# EAGLE schematic MotorBoard  (EAGLE 7.2.0)
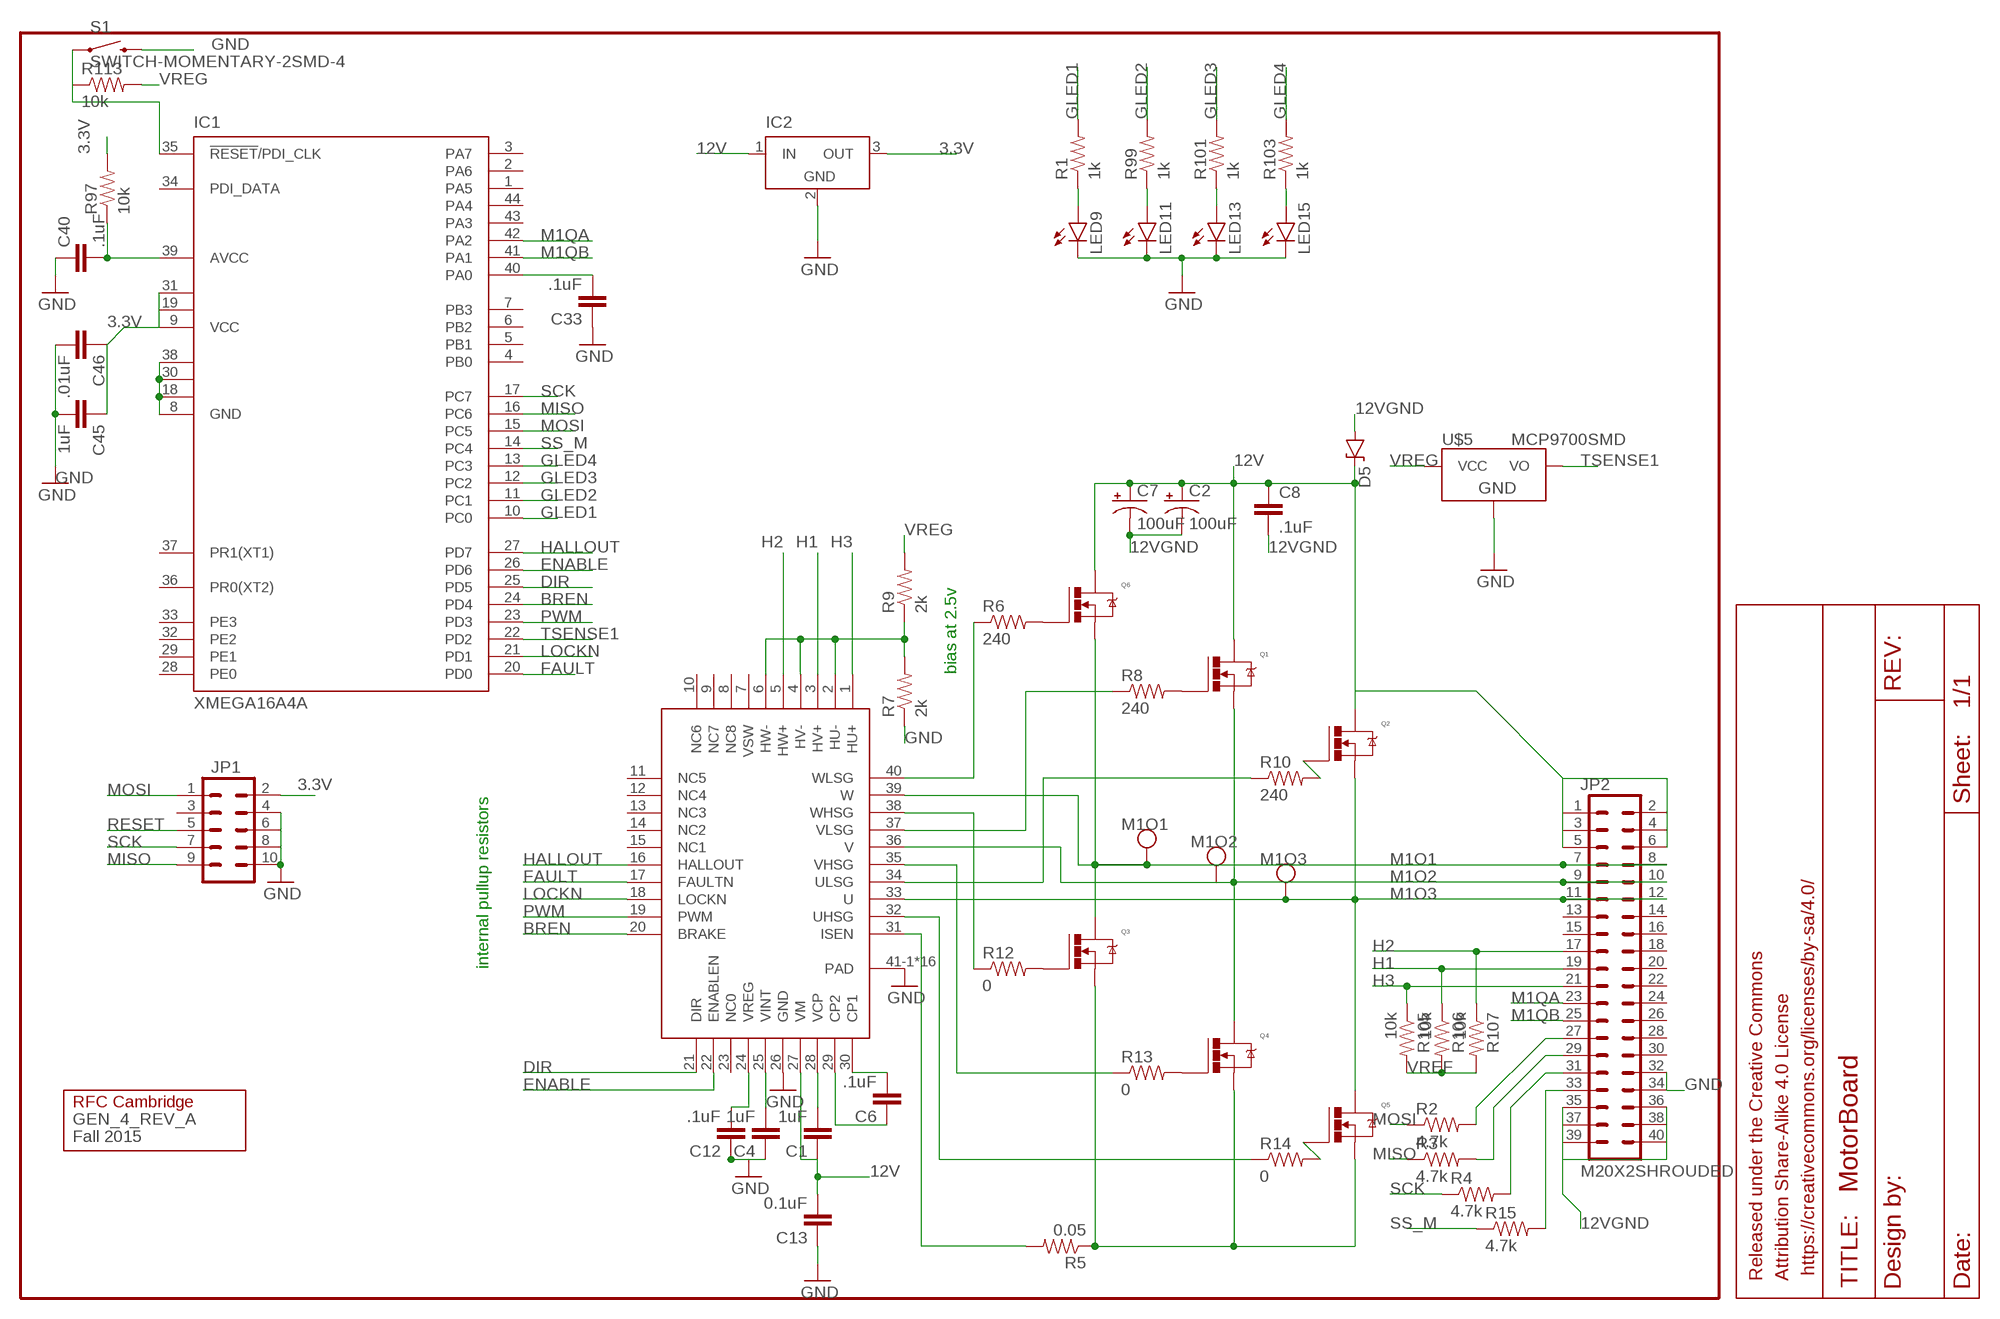
[diagram p0: schematic, sheet 1]

## Parts
C1  1uF  CAP0805  [0805]
C2  100uF  CAP-POLAR  [PANASONIC_D]
C4  1uF  CAP0805  [0805]
C6  .1uF  CAP0805  [0805]
C7  100uF  CAP-POLAR  [PANASONIC_D]
C8  .1uF  CAP0805  [0805]
C12  .1uF  CAP0805  [0805]
C13  0.1uF  CAP0805  [0805]
C33  .1uF  CAP0805  [0805]
C40  .1uF  CAP0805  [0805]
C45  1uF  CAP0805  [0805]
C46  .01uF  CAP0805  [0805]
D5  DIODE-ZENERDO214AC  [DO214AC]
FRAME7  FRAME-LETTER  [CREATIVE_COMMONS]
GEN_4_REV_A  Fall 2015  LOGO  [LOGO]
IC1  XMEGA16A4A  [TQFP44]
IC2  LT1129CST5  [SOT223]
JP1  M05X2SHD-NS  [2X5-SHROUDED-NS]
JP2  M20X2SHROUDED  [2X20_SHROUDED]
LED9  LED1206  [LED-1206]
LED11  LED1206  [LED-1206]
LED13  LED1206  [LED-1206]
LED15  LED1206  [LED-1206]
M1O1  TEST_PT  [TESTING_PT]
M1O2  TEST_PT  [TESTING_PT]
M1O3  TEST_PT  [TESTING_PT]
Q1  N-MOSFET  [DPAK]
Q2  N-MOSFET  [DPAK]
Q3  N-MOSFET  [DPAK]
Q4  N-MOSFET  [DPAK]
Q5  N-MOSFET  [DPAK]
Q6  N-MOSFET  [DPAK]
R1  1k  RESISTOR0805-RES  [0805]
R2  4.7k  RESISTOR0805-RES  [0805]
R3  4.7k  RESISTOR0805-RES  [0805]
R4  4.7k  RESISTOR0805-RES  [0805]
R5  0.05  RESISTOR0805-RES  [0805]
R6  240  RESISTOR0805-RES  [0805]
R7  2k  RESISTOR0805-RES  [0805]
R8  240  RESISTOR0805-RES  [0805]
R9  2k  RESISTOR0805-RES  [0805]
R10  240  RESISTOR0805-RES  [0805]
R12  0  RESISTOR0805-RES  [0805]
R13  0  RESISTOR0805-RES  [0805]
R14  0  RESISTOR0805-RES  [0805]
R15  4.7k  RESISTOR0805-RES  [0805]
R97  10k  RESISTOR0805-RES  [0805]
R99  1k  RESISTOR0805-RES  [0805]
R101  1k  RESISTOR0805-RES  [0805]
R103  1k  RESISTOR0805-RES  [0805]
R105  10k  RESISTOR0805-RES  [0805]
R106  10k  RESISTOR0805-RES  [0805]
R107  10k  RESISTOR0805-RES  [0805]
R113  10k  RESISTOR0805-RES  [0805]
S1  SWITCH-MOMENTARY-2SMD-4  [TACTILE_SWITCH_TALL]
U$1  DRV8307  [QFN40-6X6]
U$5  MCP9700SMD  [SOT23-3]

## Nets
3.3V: C45.1 C46.1 IC1.9(VCC) IC1.19(VCC1) IC1.31(VCC2) IC2.3(OUT) R97.2
12V: C1.1 C2.+ C7.+ C8.1 C13.2 D5.C IC2.1(IN) JP2.1 JP2.2 JP2.3 JP2.4 JP2.5 JP2.6 Q1.DRAIN Q2.DRAIN Q6.DRAIN U$1.27(VM)
12VGND: C2.- C7.- C8.2 D5.A JP2.35 JP2.36 JP2.37 JP2.38 JP2.39 JP2.40
AVCC: C40.2 IC1.39(AVCC) R97.1
BREN: IC1.24(PD4) U$1.20(BRAKE)
DIR: IC1.25(PD5) U$1.21(DIR)
ENABLE: IC1.26(PD6) U$1.22(ENABLEN)
FAULT: IC1.20(PD0) U$1.17(FAULTN)
GLED1: IC1.10(PC0) R1.2
GLED2: IC1.11(PC1) R99.2
GLED3: IC1.12(PC2) R101.2
GLED4: IC1.13(PC3) R103.2
GND: C4.1 C12.1 C13.1 C33.1 C40.1 C45.2 C46.2 IC1.8(GND) IC1.18(GND1) IC1.30(GND2) IC1.38(GND3) IC2.2(GND) JP1.4 JP1.6 JP1.8 JP1.10 LED9.C LED11.C LED13.C LED15.C R7.1 S1.B2 U$1.26(GND) U$1.41-1(PAD) U$1.41-2(PAD) U$1.41-3(PAD) U$1.41-4(PAD) U$1.41-5(PAD) U$1.41-6(PAD) U$1.41-7(PAD) U$1.41-8(PAD) U$1.41-9(PAD) U$1.41-10(PAD) U$1.41-11(PAD) U$1.41-12(PAD) U$1.41-13(PAD) U$1.41-14(PAD) U$1.41-15(PAD) U$1.41-16(PAD) U$5.3(GND)
H1: JP2.19 R106.1 U$1.3(HV+)
H2: JP2.17 R107.1 U$1.5(HW+)
H3: JP2.21 R105.1 U$1.1(HU+)
HALLOUT: IC1.27(PD7) U$1.16(HALLOUT)
LOCKN: IC1.21(PD1) U$1.18(LOCKN)
M1O1: JP2.7 JP2.8 M1O1.P$1 Q3.DRAIN Q6.SOURCE U$1.39(W)
M1O2: JP2.9 JP2.10 M1O2.P$1 Q1.SOURCE Q4.DRAIN U$1.36(V)
M1O3: JP2.11 JP2.12 M1O3.P$1 Q2.SOURCE Q5.DRAIN U$1.33(U)
M1QA: IC1.42(PA2) JP2.23
M1QB: IC1.41(PA1) JP2.25
MISO: IC1.16(PC6) R3.1
MOSI: IC1.15(PC5) JP1.1 R2.1
N$1: LED9.A R1.1
N$2: C6.2 U$1.30(CP1)
N$3: JP2.29 R3.2
N$4: JP2.31 R4.2
N$5: R5.2 U$1.31(ISEN)
N$6: Q6.GATE R6.2
N$7: Q1.GATE R8.2
N$8: C33.2 IC1.40(PA0)
N$9: C6.1 U$1.29(CP2)
N$10: Q2.GATE R10.2
N$11: Q3.GATE R12.2
N$12: C1.2 U$1.28(VCP)
N$13: Q4.GATE R13.2
N$14: Q5.GATE R14.2
N$15: C4.2 U$1.25(VINT)
N$16: R6.1 U$1.40(WLSG)
N$17: R14.1 U$1.32(UHSG)
N$18: R13.1 U$1.35(VHSG)
N$19: R12.1 U$1.38(WHSG)
N$20: R8.1 U$1.37(VLSG)
N$21: R10.1 U$1.34(ULSG)
N$29: R7.2 R9.1 U$1.2(HU-) U$1.4(HV-) U$1.6(HW-)
N$33: JP2.32 JP2.34
N$34: JP2.33 R15.2
N$45: JP2.27 R2.2
N$114: LED11.A R99.1
N$117: LED13.A R101.1
N$119: LED15.A R103.1
O1: Q3.SOURCE Q4.SOURCE Q5.SOURCE R5.1
PWM: IC1.23(PD3) U$1.19(PWM)
RESET: IC1.35(!RESET!/PDI_CLK) JP1.5 R113.1 S1.A2
SCK: IC1.17(PC7) JP1.7 R4.1
SS_M: IC1.14(PC4) R15.1
TSENSE1: IC1.22(PD2) U$5.2(VO)
VREF: R105.2 R106.2 R107.2
VREG: C12.2 JP1.2 R9.2 R113.2 U$1.24(VREG) U$5.1(VCC)
Unconnected: IC1.1(PA5) IC1.2(PA6) IC1.3(PA7) IC1.4(PB0) IC1.5(PB1) IC1.6(PB2) IC1.7(PB3) IC1.28(PE0) IC1.29(PE1) IC1.32(PE2) IC1.33(PE3) IC1.34(PDI_DATA) IC1.36(PR0(XT2)) IC1.37(PR1(XT1)) IC1.43(PA3) IC1.44(PA4) JP1.3 JP1.9 JP2.13 JP2.14 JP2.15 JP2.16 JP2.18 JP2.20 JP2.22 JP2.24 JP2.26 JP2.28 JP2.30 U$1.7(VSW) U$1.8(NC8) U$1.9(NC7) U$1.10(NC6) U$1.11(NC5) U$1.12(NC4) U$1.13(NC3) U$1.14(NC2) U$1.15(NC1) U$1.23(NC0)

## Notes on the sheet
- bias at 2.5v
- RESET
- internal pullup resistors
- DIR
- ENABLE

## Power pins joined to a net without a drawn wire
GND: IC2.4(GND)

## Library data of the parts
C1 C4 C6 C8 C12 C13 = SparkFun-Passives:CAP: Capacitor Standard 0603 ceramic capacitor, and 0.1" leaded capacitor.
C2 C7 = gen3:CAP-POLAR: Cap Alum Polarized Digikey: 493-3953-1-ND low impedence, low ceiling cap; PROD_ID: CAP-10547
C33 C40 C45 C46 = SparkFun-Capacitors:CAP: Capacitor Standard 0603 ceramic capacitor, and 0.1" leaded capacitor.
D5 = gen3:DIODE-ZENER: Zener Diode Production Part - 8199 3.4V Zener Voltage
FRAME7 = SparkFun-Aesthetics:FRAME-LETTER: Schematic Frame Standard 8.5x11 US Letter frame
GEN_4_REV_A = gen3:LOGO
IC1 = atmel:XMEGA16A4: MICROCONTROLLER Features High-performance, Low-power 8/16-bit AVR XMEGA Microcontroller Non-Volatile Program and Data Memories - 16 KB - 128 KB of In-System Self-Programmable Flash - 4 KB - 8 KB Boot Code Section with Independent Lock Bits - 1 KB - 2 KB EEPROM - 2 KB - 8 KB Internal SRAM Peripheral Features - Four-channel DMA Controller with support for external requests - Eight-channel Event System - Five 16-bit Timer/Counters Three Timer/Counters with 4 Output Compare or Input Capture channels Two Timer/Counters with 2 Output Compare or Input Capture channels High-Resolution Extensions on all Timer/Counters Advanced Waveform Extension on one Timer/Counter - Five USARTs IrDA Extension on one USART - Two Two-Wire Interfaces with dual address match (I2C and SMBus compatible) - Two SPIs (Serial Peripheral Interfaces) peripherals - AES and DES Crypto Engine - 16-bit Real Time Counter with Separate Oscillator - One Twelve-channel, 12-bit, 2 Msps Analog to Digital Converter - One Two-channel, 12-bit, 1 Msps Digital to Analog Converter - Two Analog Comparators with Window compare function - External Interrupts on all General Purpose I/O pins - Programmable Watchdog Timer with Separate On-chip Ultra Low Power Oscillator Special Microcontroller Features - Power-on Reset and Programmable Brown-out Detection - Internal and External Clock Options with PLL - Programmable Multi-level Interrupt Controller - Sleep Modes: Idle, Power-down, Standby, Power-save, Extended Standby - Advanced Programming, Test and Debugging Interfaces PDI (Program and Debug Interface) for programming, test and debugging I/O and Packages - 34 Programmable I/O Lines - 44 - lead TQFP - 44 - pad VQFN/QFN - 49 - ball VFBGA Operating Voltage - 1.6 - 3.6V Speed performance - 0 - 12 MHz @ 1.6 - 3.6V - 0 - 32 MHz @ 2.7 - 3.6V Drawn by Dipl.-Ing. (FH) Robert Siegler Created: 27.05.09; OC_FARNELL: unknown; OC_NEWARK: unknown
IC2 = linear-technology:LT1129CST5: VOLTAGE REGULATOR with shutdown; MPN: LT1129CST-5#PBF; OC_FARNELL: 1663375; OC_NEWARK: 57M2069
JP1 = SparkFun-Connectors:M05X2: Header 5x2 Standard 10-pin dual row 0.1" header. Commonly used with AVR-ISP. Use with Spark Fun Electronics SKU: PRT-00778
JP2 = SparkFun-Connectors:M20X2: 0.1" spaced headers; PROD_ID: CONN-12263
LED9 LED11 LED13 LED15 = SparkFun-LED:LED: LEDs Standard schematic elements and footprints for 5mm, 3mm, 1206, and 0603 sized LEDs. 5mm - Spark Fun Electronics SKU : COM-00529 (and others)
M1O1-M1O3 = gen3:TEST_PT: Testing Point Use to probe a signal
Q1-Q6 = rfc:N-MOSFET: N-Channel Power Mosfet
R1-R4 R15 R97 R99 R101 R103 R113 = SparkFun-Passives:RESISTOR: Resistor Basic schematic elements and footprints for 0603, 1206, and PTH resistors.
R5-R10 R12-R14 R105-R107 = SparkFun-Resistors:RESISTOR: Resistor Basic schematic elements and footprints for 0603, 1206, and PTH resistors.
S1 = SparkFun-Electromechanical:SWITCH-MOMENTARY-2: Various NO switches- pushbuttons, reed, etc; PROD_ID: SWCH-11966
U$1 = texas2:DRV8307
U$5 = SparkFun-Sensors:MCP9700: Analog-output temperature sensor; PROD_ID: IC-08917